# EAGLE schematic NSE2022_ALL (EAGLE 9.6.0)
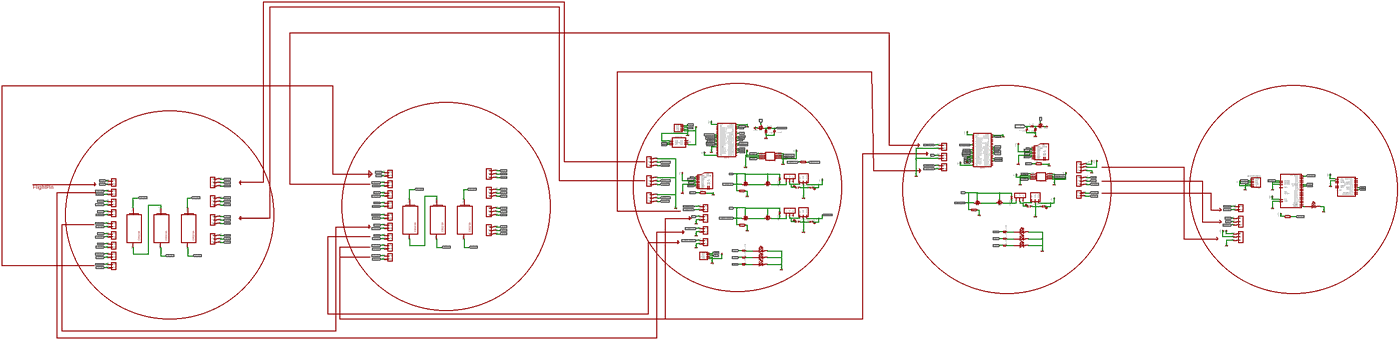
[diagram p0: schematic, sheet 1, overview]
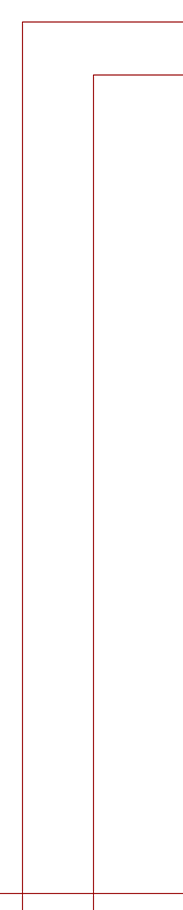
[diagram p1: schematic, sheet 1, part 1 of 8]
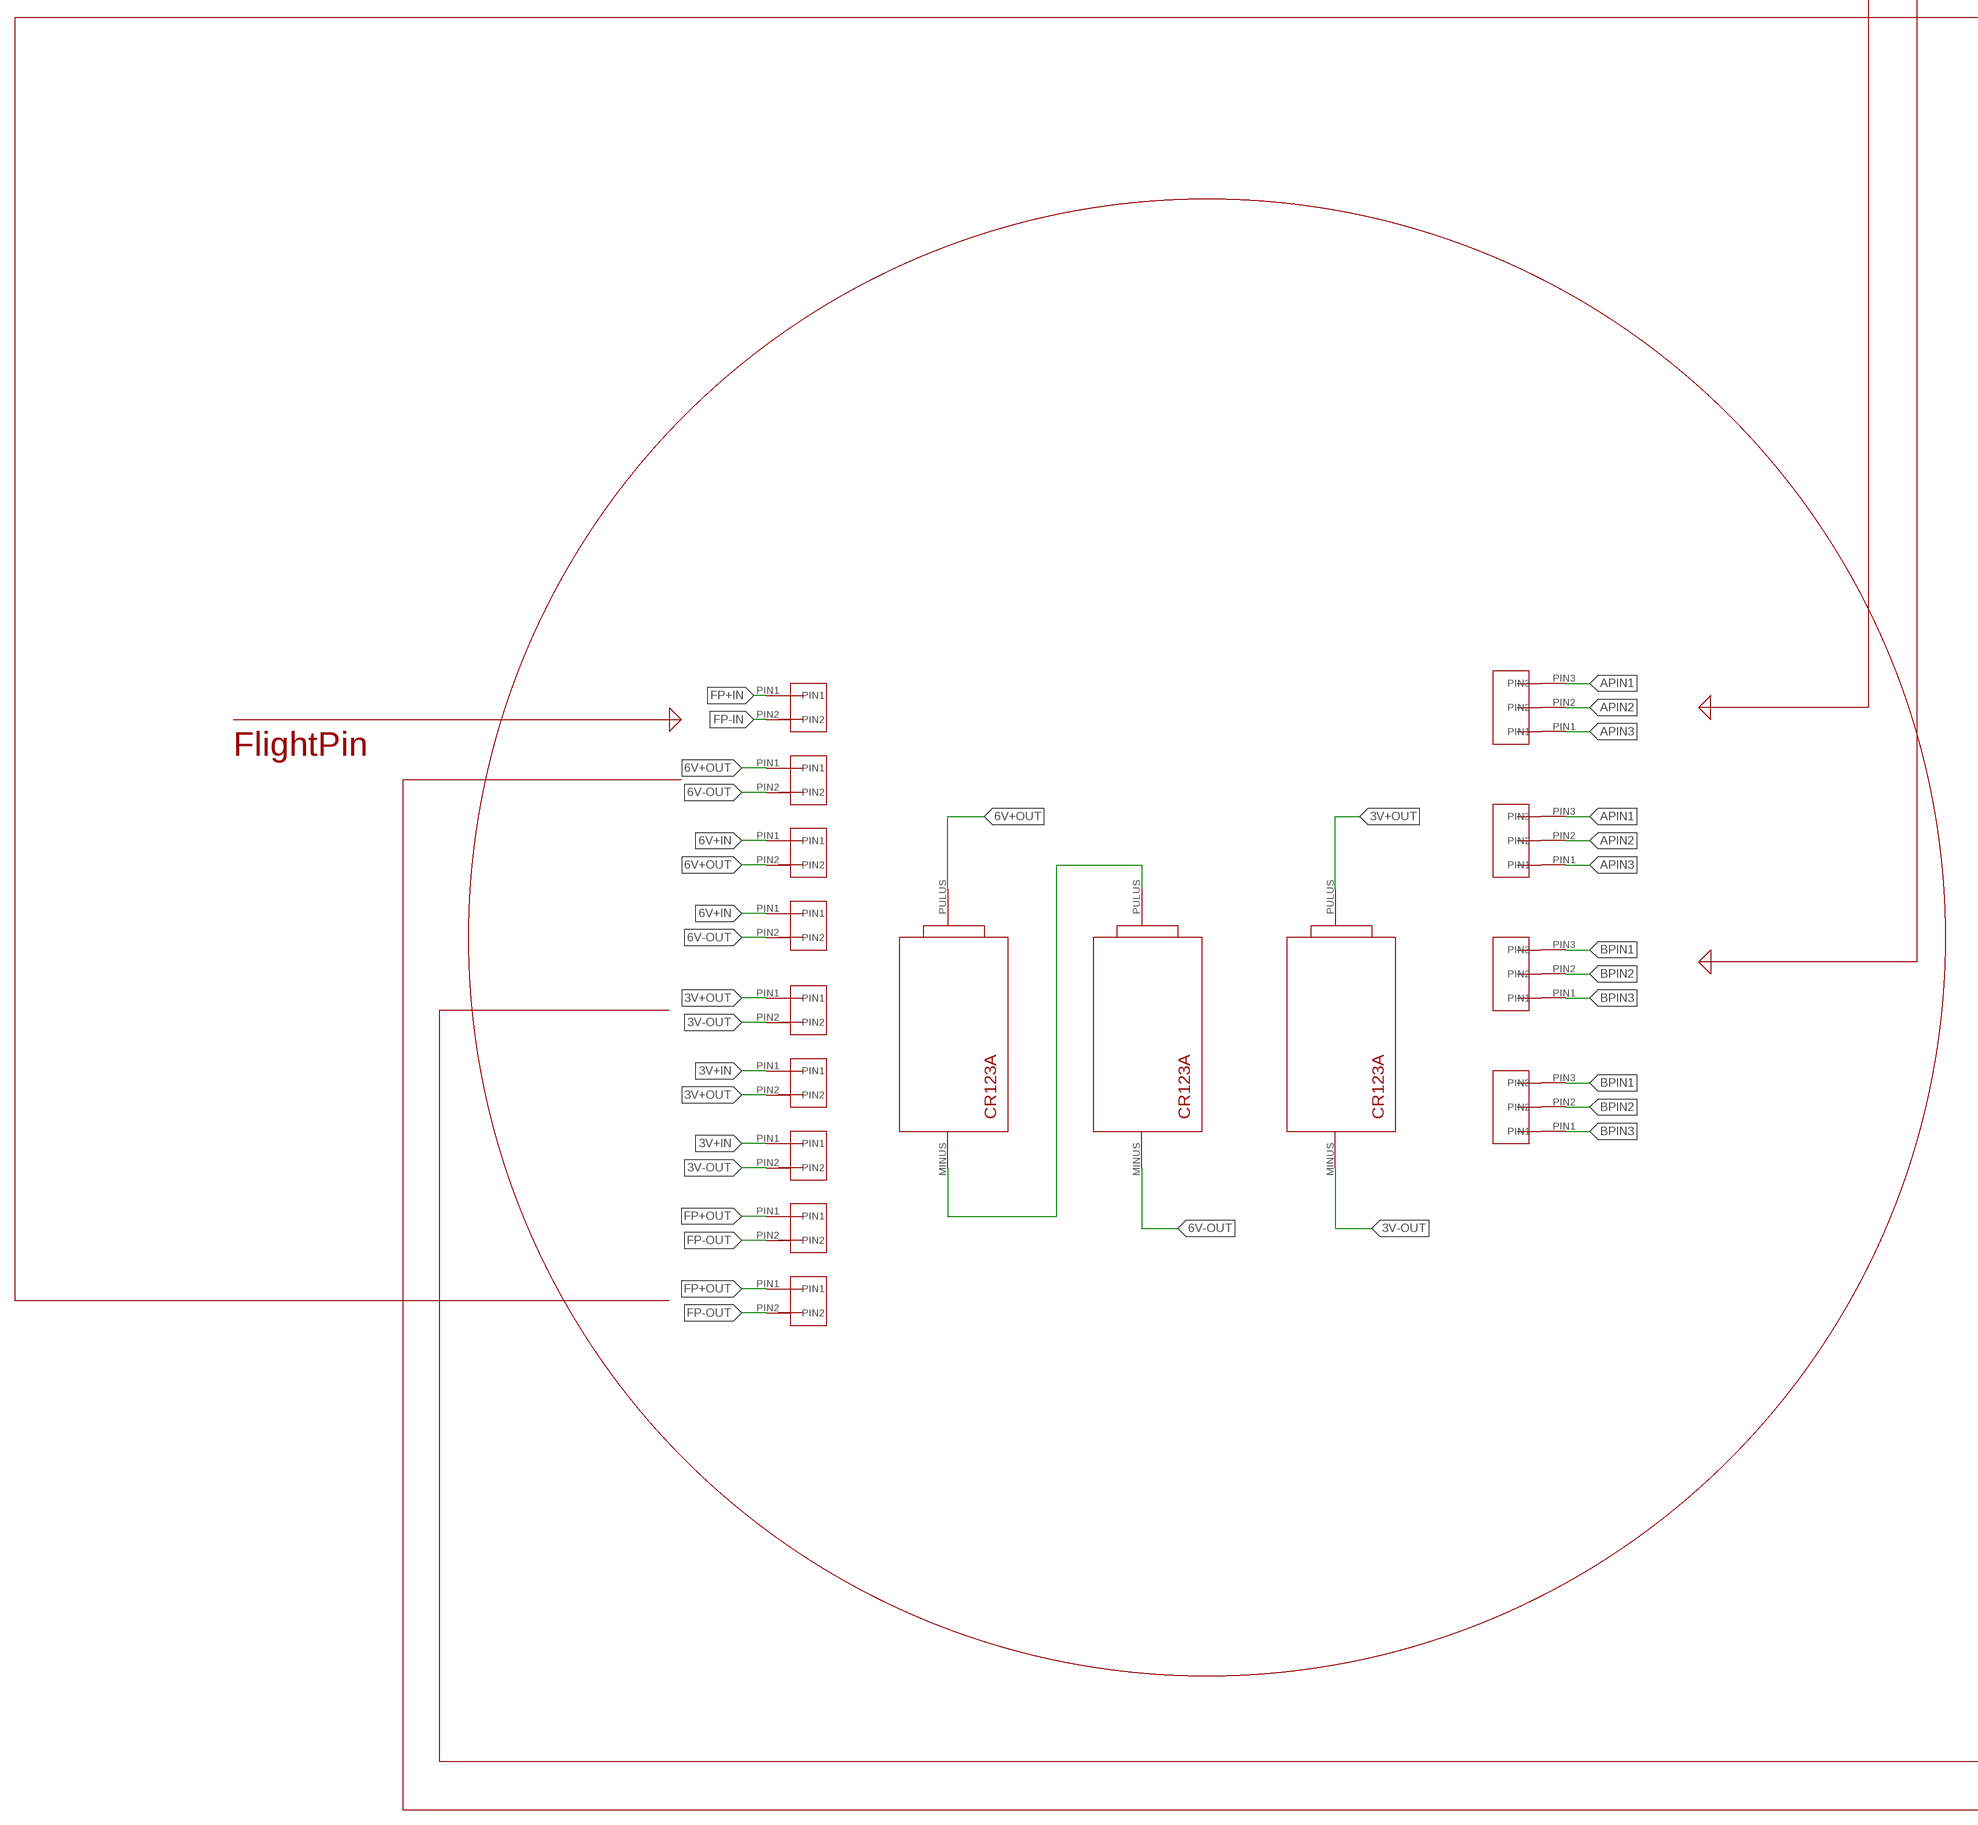
[diagram p2: schematic, sheet 1, part 2 of 8]
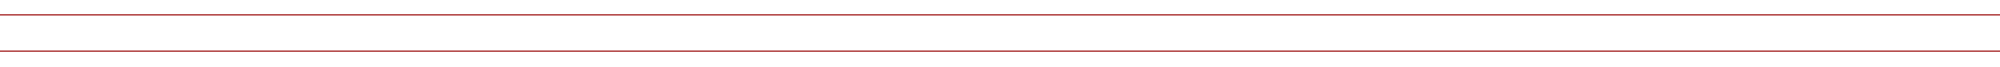
[diagram p3: schematic, sheet 1, part 3 of 8]
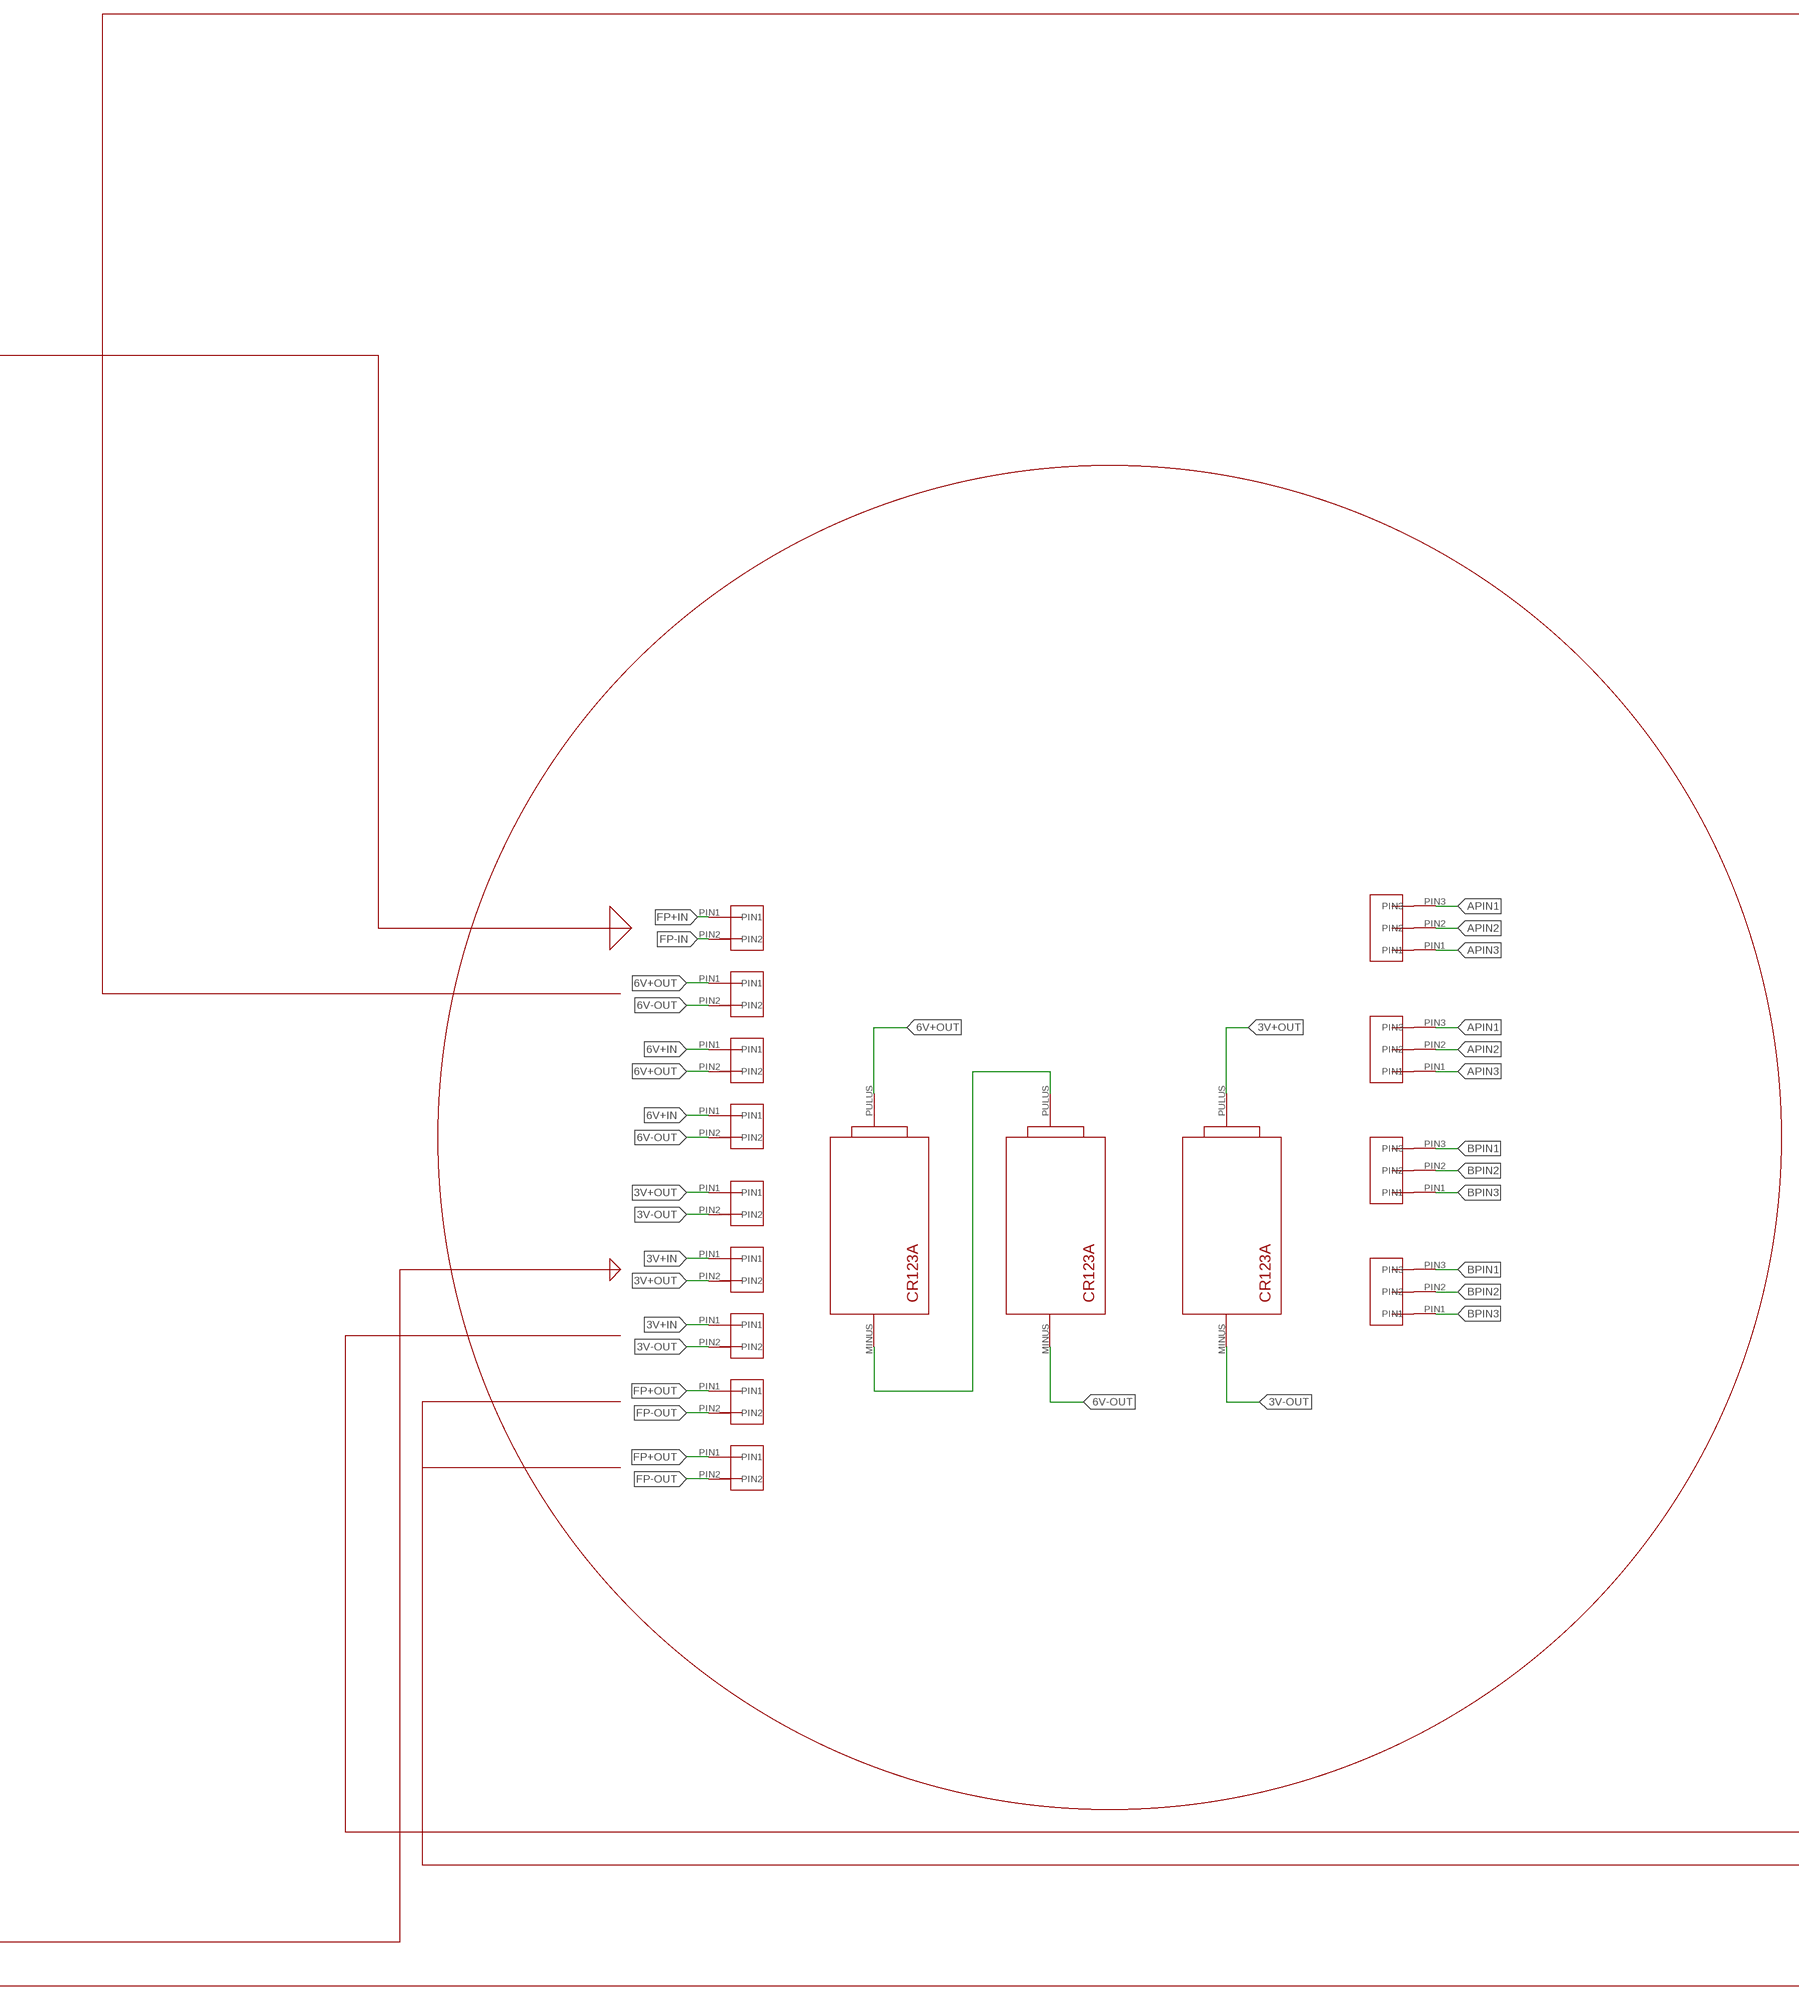
[diagram p4: schematic, sheet 1, part 4 of 8]
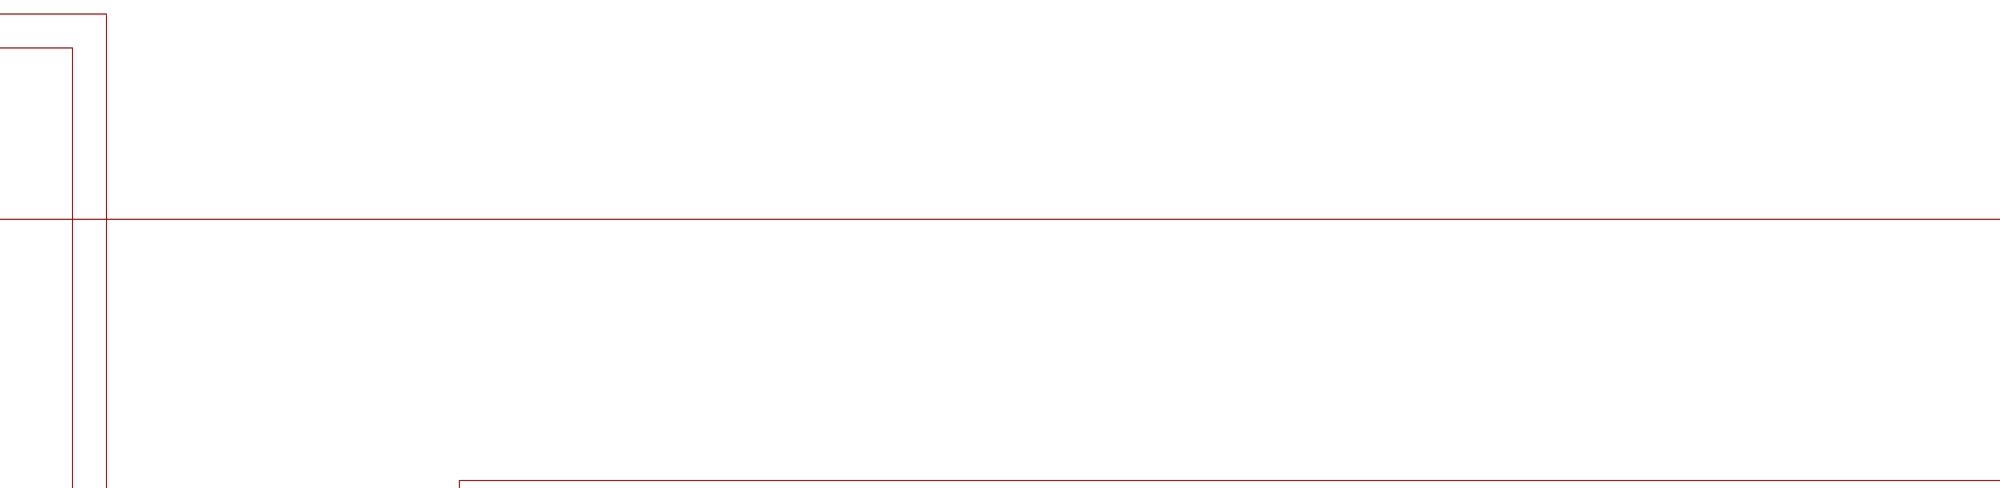
[diagram p5: schematic, sheet 1, part 5 of 8]
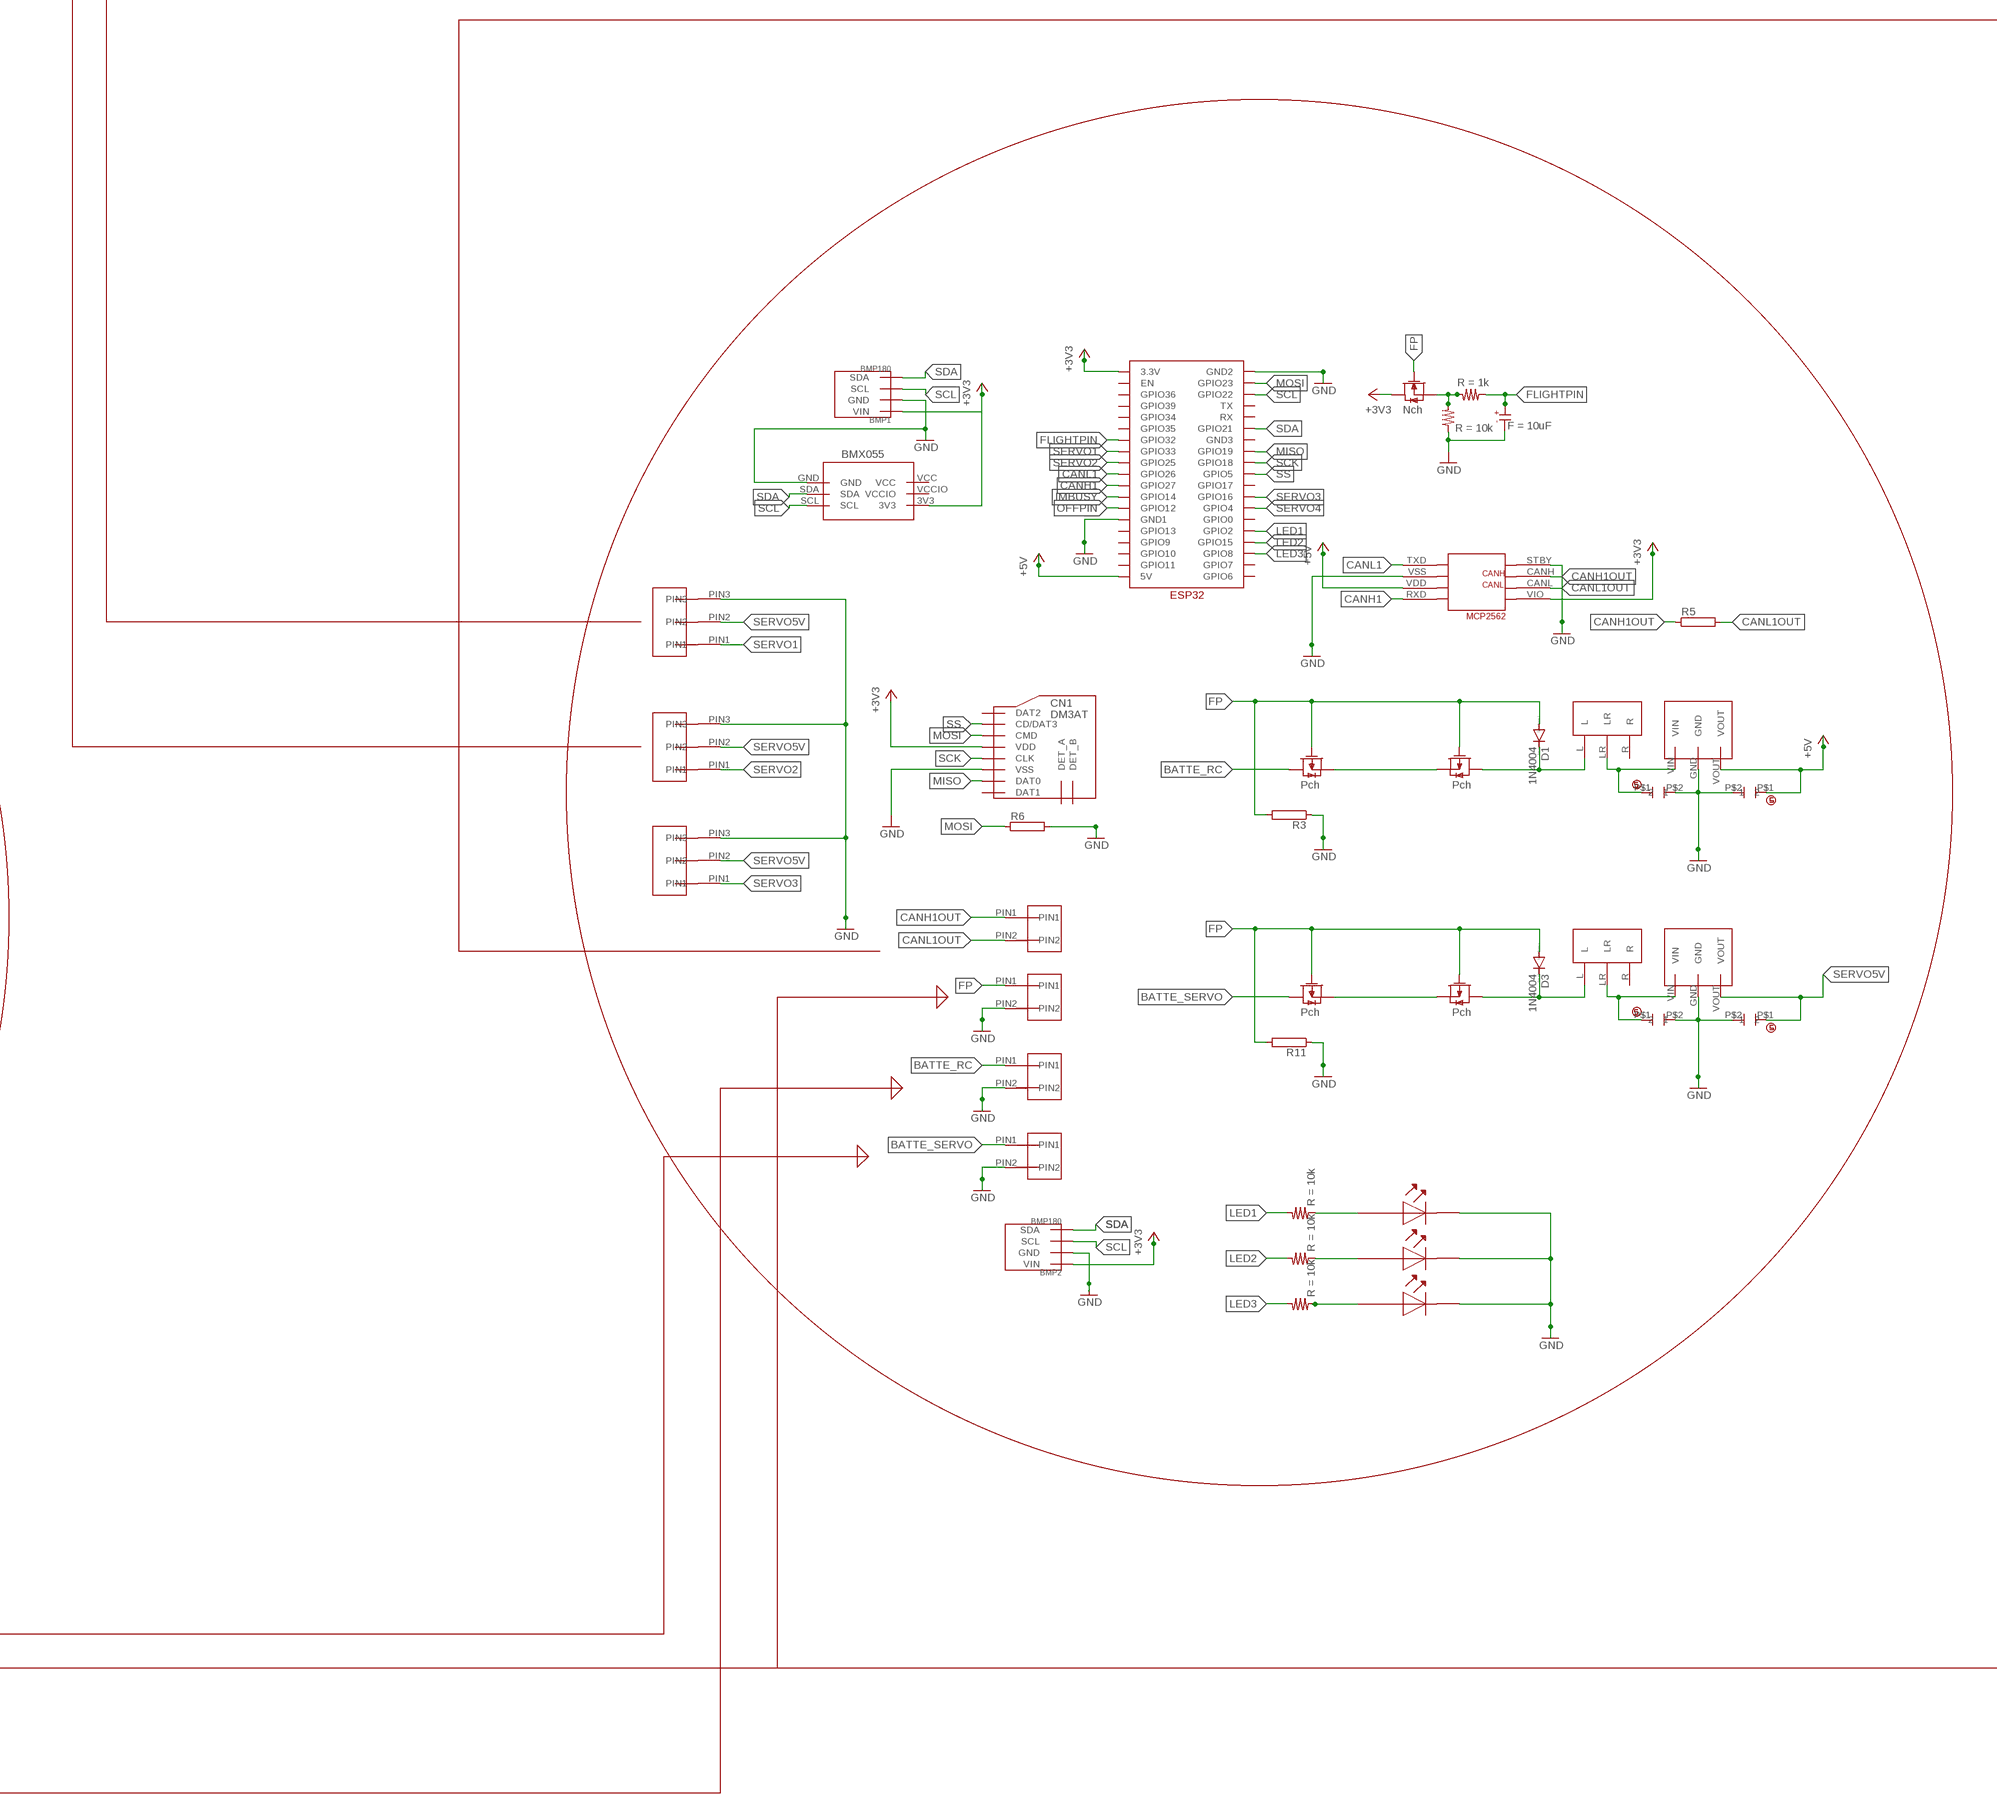
[diagram p6: schematic, sheet 1, part 6 of 8]
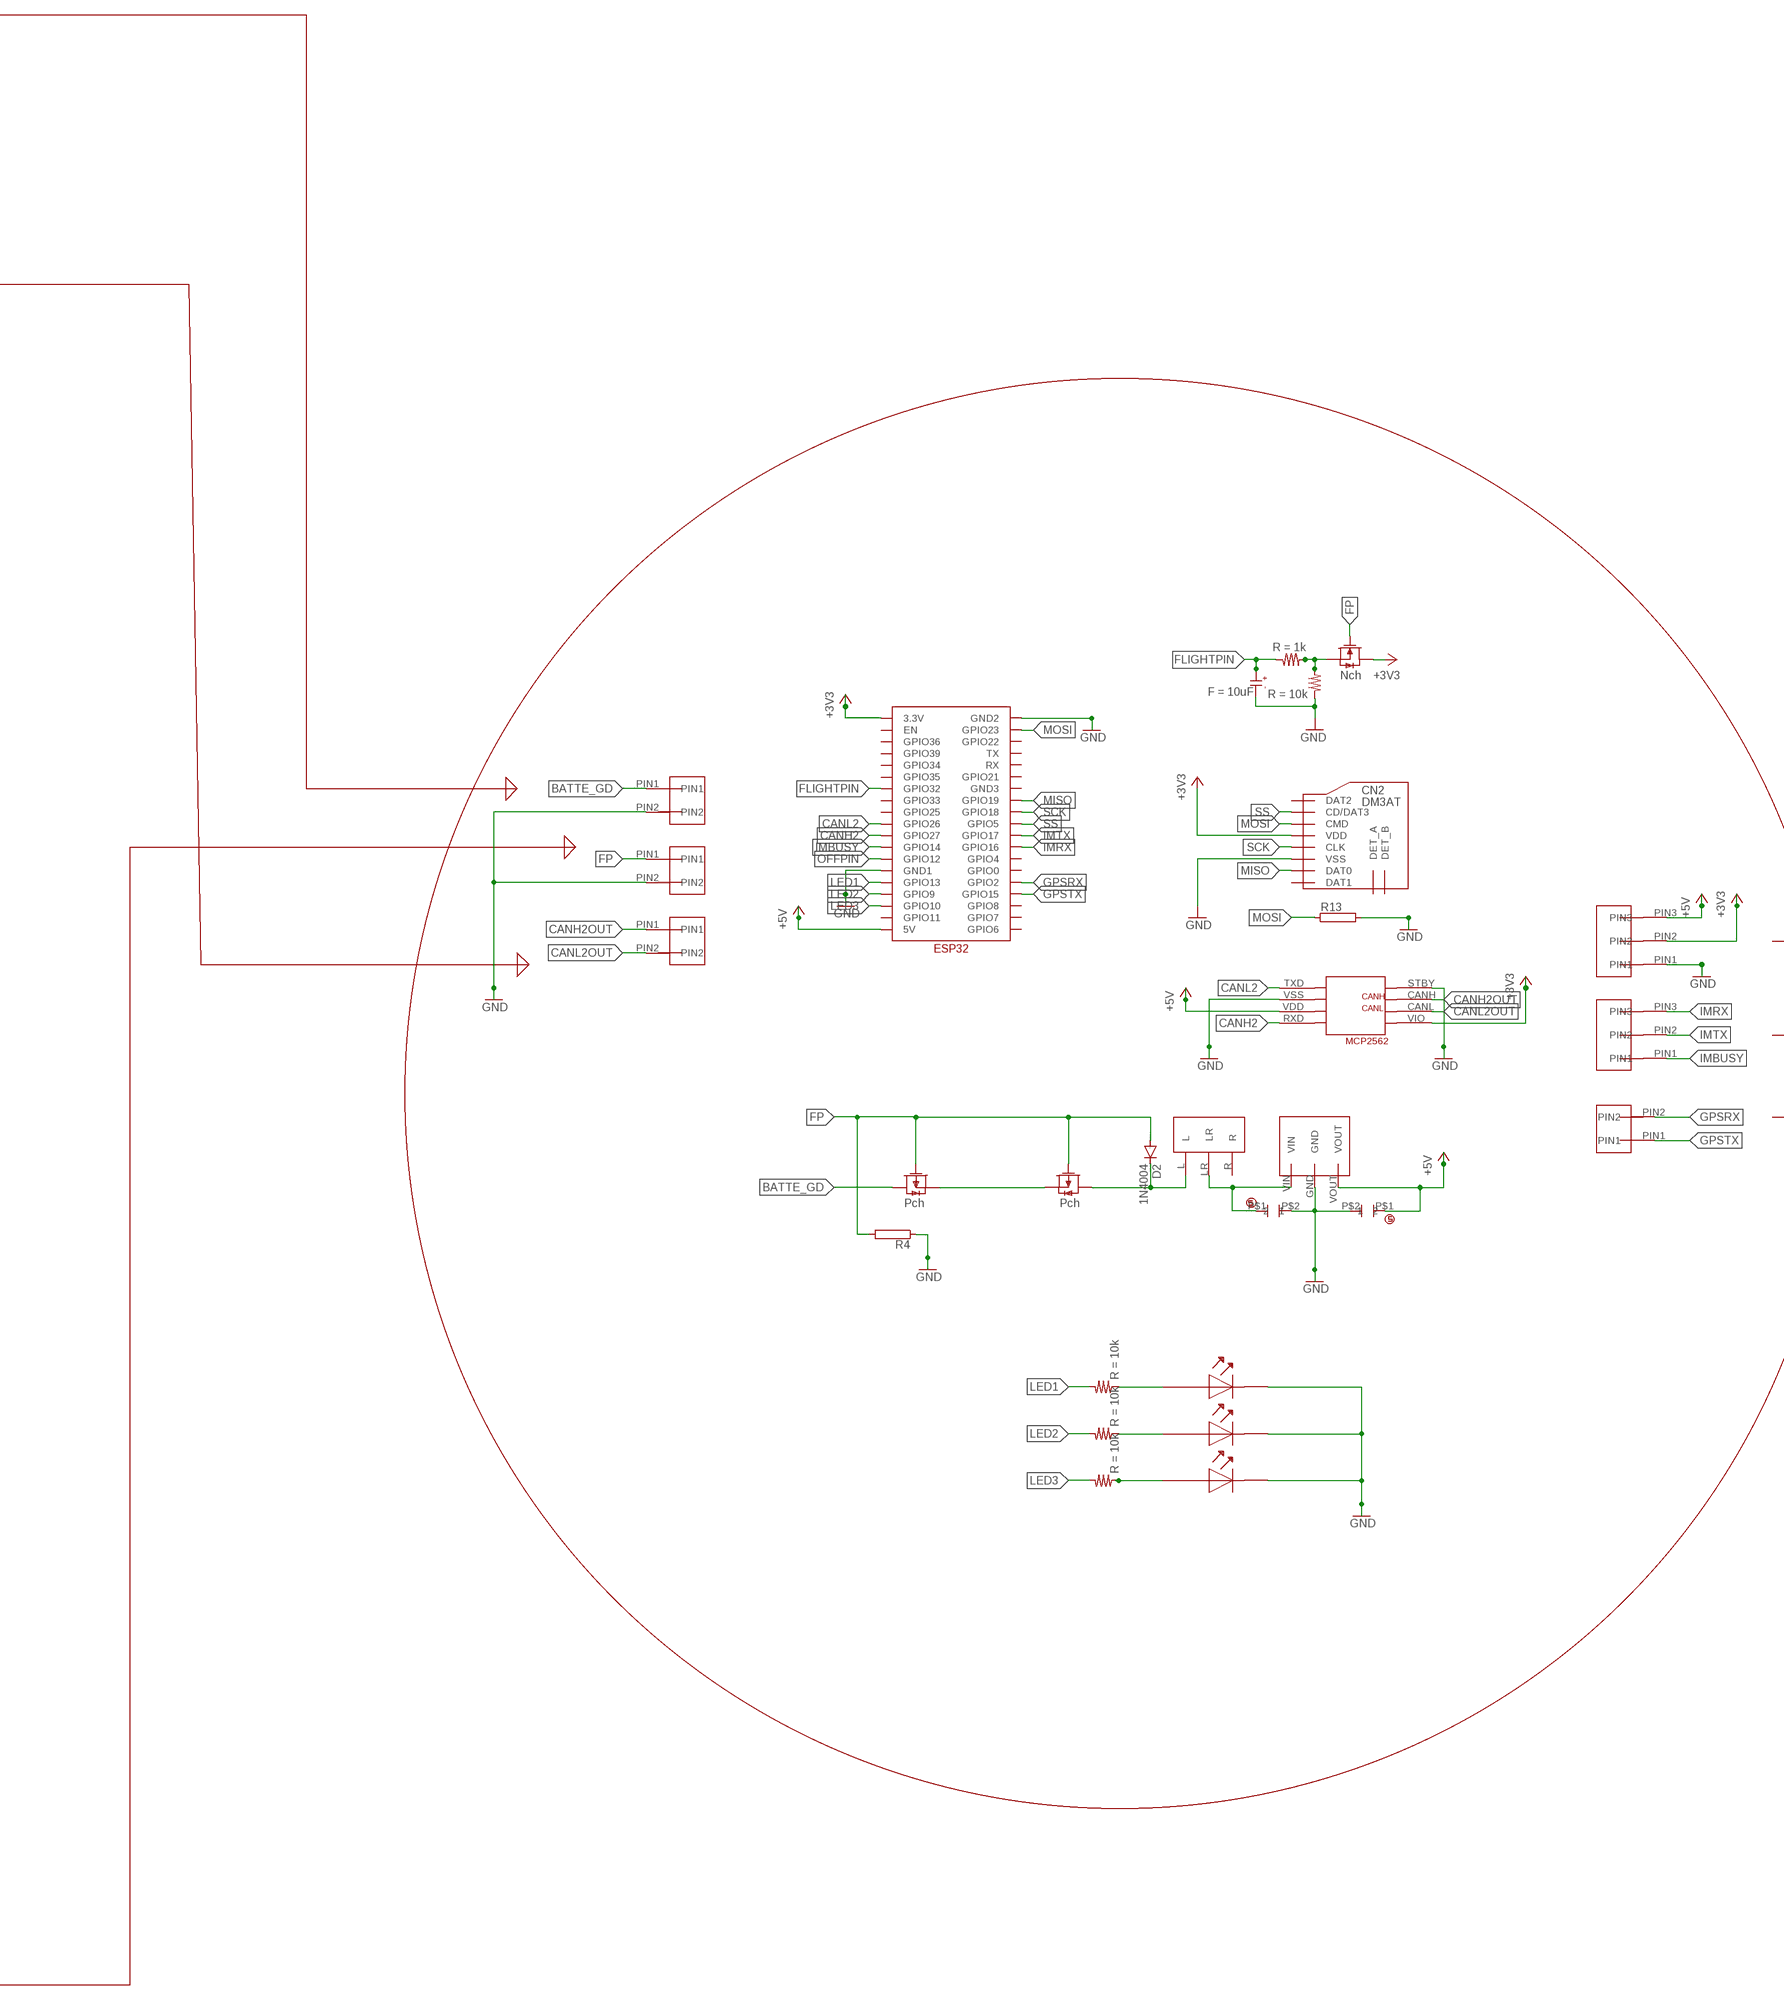
[diagram p7: schematic, sheet 1, part 7 of 8]
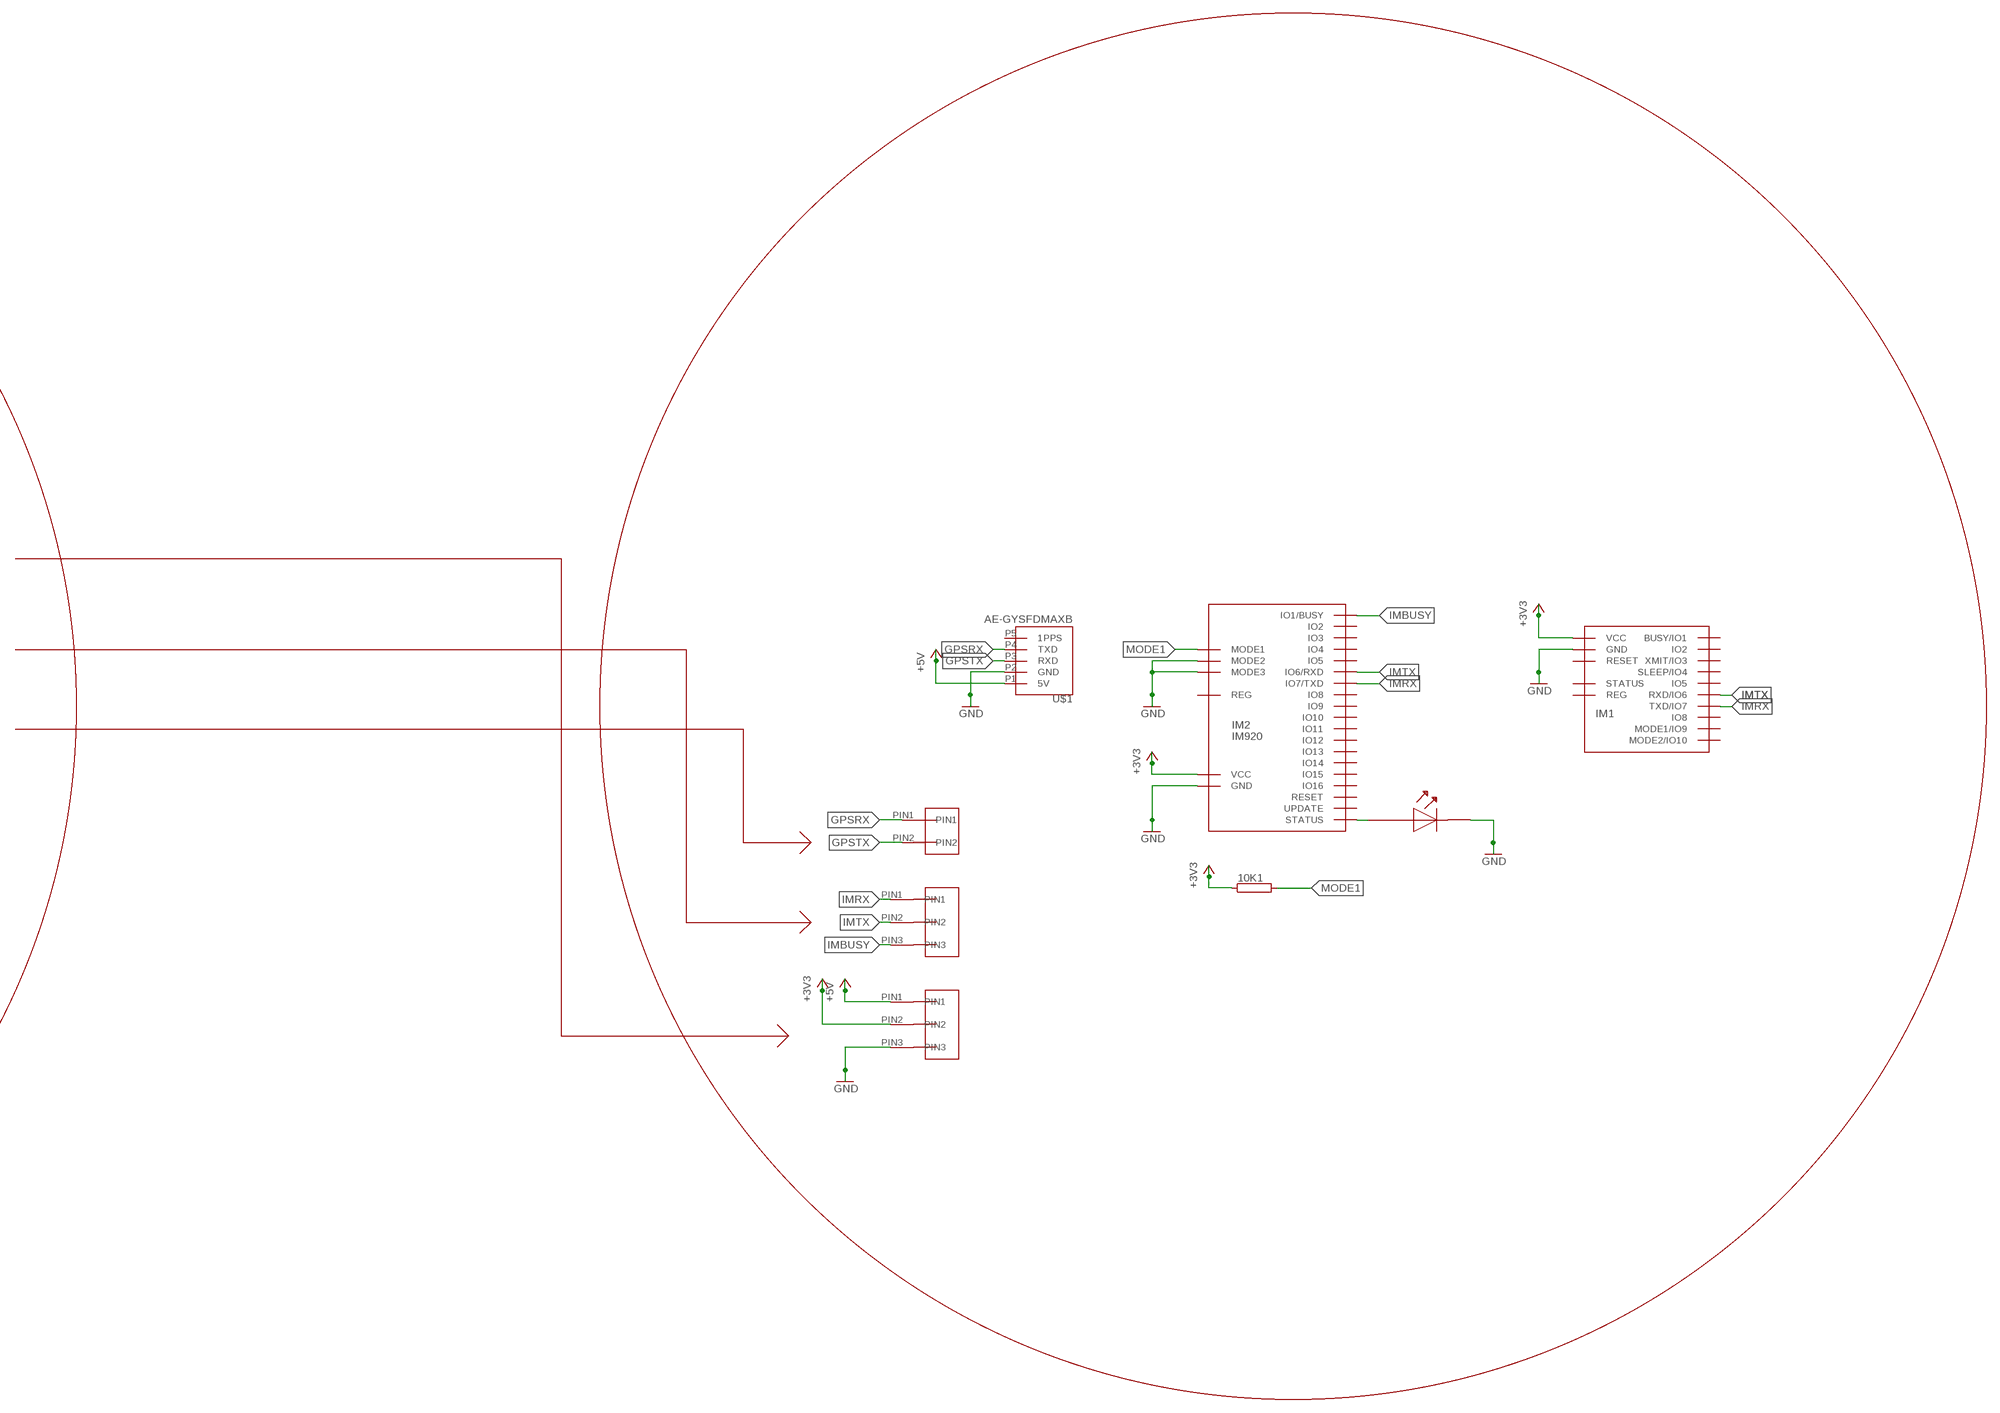
[diagram p8: schematic, sheet 1, part 8 of 8]

## Parts
10K1  RRS02B  [RS02B]
BMP1  BMP180  [GY-68]
BMP2  BMP180  [GY-68]
BMX1  BMX055  [BMX055]
C1  CAPACITOR-ELECTROLYTIC_1  [CAPACITOR-ELECTROLYTIC_1]
C3  CAPACITOR-ELECTROLYTIC_1  [CAPACITOR-ELECTROLYTIC_1]
CERAMIC_CAPACITOR1  CERAMIC_CAPACITOR  [CERAMIC_CAPACITOR]
CERAMIC_CAPACITOR2  CERAMIC_CAPACITOR  [CERAMIC_CAPACITOR]
CERAMIC_CAPACITOR3  CERAMIC_CAPACITOR  [CERAMIC_CAPACITOR]
CERAMIC_CAPACITOR4  CERAMIC_CAPACITOR  [CERAMIC_CAPACITOR]
CERAMIC_CAPACITOR5  CERAMIC_CAPACITOR  [CERAMIC_CAPACITOR]
CERAMIC_CAPACITOR6  CERAMIC_CAPACITOR  [CERAMIC_CAPACITOR]
CN1  DM3AT  [DM3AT]
CN2  DM3AT  [DM3AT]
D1  1N4004  [DO41-10]
D2  1N4004  [DO41-10]
D3  1N4004  [DO41-10]
IM1  IM920C  [IM920C]
IM2  IM920  [IM920]
R1  RESISTER  [REGISTER]
R2  RESISTER  [REGISTER]
R3  RRS02B  [RS02B]
R4  RRS02B  [RS02B]
R5  RRS02B  [RS02B]
R6  RRS02B  [RS02B]
R7  RESISTER  [REGISTER]
R8  RESISTER  [REGISTER]
R9  RESISTER  [REGISTER]
R10  RESISTER  [REGISTER]
R11  RRS02B  [RS02B]
R12  RESISTER  [REGISTER]
R13  RRS02B  [RS02B]
R14  RESISTER  [REGISTER]
R15  RESISTER  [REGISTER]
R16  RESISTER  [REGISTER]
SRIDE_SWTCH1  SRIDE_SWITCH  [SRIDE_SWITCH]
SRIDE_SWTCH2  SRIDE_SWITCH  [SRIDE_SWITCH]
SRIDE_SWTCH3  SRIDE_SWITCH  [SRIDE_SWITCH]
U$1  AE-GYSFDMAXB  [AE-GYSFDMAXB]
U$2  2PIN  [2PIN]
U$3  2SJ681-PCH  [2SJ681]
U$4  ESP32  [ESP32]
U$5  2SJ681-PCH  [2SJ681]
U$6  M78AR05-1  [M78AR05-1]
U$7  2SK4017-NCH  [2SK4017]
U$8  2SK4017-NCH  [2SK4017]
U$9  2PIN  [2PIN]
U$10  2PIN  [2PIN]
U$11  2PIN  [2PIN]
U$12  2SJ681-PCH  [2SJ681]
U$13  2SJ681-PCH  [2SJ681]
U$14  M78AR05-1  [M78AR05-1]
U$15  CR123A  [CR123A]
U$16  CR123A  [CR123A]
U$17  CR123A  [CR123A]
U$18  2PIN  [2PIN]
U$19  2PIN  [2PIN]
U$20  2PIN  [2PIN]
U$21  2PIN  [2PIN]
U$22  2PIN  [2PIN]
U$23  2PIN  [2PIN]
U$24  2PIN  [2PIN]
U$25  CR123A  [CR123A]
U$26  ESP32  [ESP32]
U$27  MCP2562  [MCP2562]
U$28  MCP2562  [MCP2562]
U$29  2PIN  [2PIN]
U$30  2SJ681-PCH  [2SJ681]
U$31  2SJ681-PCH  [2SJ681]
U$32  M78AR05-1  [M78AR05-1]
U$33  2PIN  [2PIN]
U$34  CR123A  [CR123A]
U$35  2PIN  [2PIN]
U$36  2PIN  [2PIN]
U$37  2PIN  [2PIN]
U$38  CR123A  [CR123A]
U$39  2PIN  [2PIN]
U$40  2PIN  [2PIN]
U$41  2PIN  [2PIN]
U$42  3PIN  [3PIN]
U$43  3PIN  [3PIN]
U$44  3PIN  [3PIN]
U$45  2PIN  [2PIN]
U$46  3PIN  [3PIN]
U$47  3PIN  [3PIN]
U$48  3PIN  [3PIN]
U$49  3PIN  [3PIN]
U$50  3PIN  [3PIN]
U$51  3PIN  [3PIN]
U$52  3PIN  [3PIN]
U$53  3PIN  [3PIN]
U$54  LED  [LED]
U$55  LED  [LED]
U$56  2PIN  [2PIN]
U$57  2PIN  [2PIN]
U$58  2PIN  [2PIN]
U$59  3PIN  [3PIN]
U$60  3PIN  [3PIN]
U$61  3PIN  [3PIN]
U$62  3PIN  [3PIN]
U$63  LED  [LED]
U$64  LED  [LED]
U$65  2PIN  [2PIN]
U$66  2PIN  [2PIN]
U$67  2PIN  [2PIN]
U$68  2PIN  [2PIN]
U$69  LED  [LED]
U$70  LED  [LED]
U$71  LED  [LED]

## Nets
3V+IN: U$2.PIN1 U$37.PIN1 U$56.PIN1 U$65.PIN1
3V+OUT: U$17.PULUS(PULAS) U$36.PIN1 U$37.PIN2 U$38.PULUS(PULAS) U$45.PIN1 U$56.PIN2
3V-OUT: U$2.PIN2 U$17.MINUS U$36.PIN2 U$38.MINUS U$45.PIN2 U$65.PIN2
6V+IN: U$10.PIN1 U$11.PIN1 U$67.PIN1 U$68.PIN1
6V+OUT: U$10.PIN2 U$15.PULUS(PULAS) U$25.PULUS(PULAS) U$35.PIN1 U$41.PIN1 U$67.PIN2
6V-OUT: U$11.PIN2 U$16.MINUS U$34.MINUS U$35.PIN2 U$41.PIN2 U$68.PIN2
+3V3: 10K1.1 BMP1.P1(VIN) BMP2.P1(VIN) BMX1.3V3 CN1.VDD CN2.VDD IM1.$P17(VCC) IM2.IO23(VCC) U$4.3.3V U$7.DRAIN U$8.DRAIN U$26.3.3V U$27.VIO U$28.VIO U$46.PIN2 U$48.PIN2
+5V: CERAMIC_CAPACITOR1.P$1 CERAMIC_CAPACITOR5.P$1 U$1.P1(5V) U$4.5V U$6.VOUT U$26.5V U$27.VDD U$28.VDD U$32.VOUT U$46.PIN3 U$48.PIN1
APIN1: U$50.PIN3 U$51.PIN3 U$59.PIN3 U$60.PIN3
APIN2: U$50.PIN2 U$51.PIN2 U$59.PIN2 U$60.PIN2
APIN3: U$50.PIN1 U$51.PIN1 U$59.PIN1 U$60.PIN1
BATTE_GD: U$5.DRAIN U$22.PIN1
BATTE_RC: U$20.PIN1 U$30.DRAIN
BATTE_SERVO: U$13.DRAIN U$21.PIN1
BPIN1: U$52.PIN3 U$53.PIN3 U$61.PIN3 U$62.PIN3
BPIN2: U$52.PIN2 U$53.PIN2 U$61.PIN2 U$62.PIN2
BPIN3: U$52.PIN1 U$53.PIN1 U$61.PIN1 U$62.PIN1
CANH1: U$4.GPIO27 U$27.RXD
CANH1OUT: R5.1 U$18.PIN1 U$27.CANH
CANH2: U$26.GPIO27 U$28.RXD
CANH2OUT: U$24.PIN1 U$28.CANH
CANL1: U$4.GPIO26 U$27.TXD
CANL1OUT: R5.2 U$18.PIN2 U$27.CANL
CANL2: U$26.GPIO26 U$28.TXD
CANL2OUT: U$24.PIN2 U$28.CANL
FLIGHTPIN: C1.KS C3.KS R8.A R10.A U$4.GPIO32 U$26.GPIO32
FP: D1.A D2.A D3.A R3.2 R4.2 R11.2 U$3.GATE U$5.GATE U$7.GATE U$8.GATE U$12.GATE U$13.GATE U$19.PIN1 U$23.PIN1 U$30.GATE U$31.GATE
FP+IN: U$39.PIN1 U$57.PIN1
FP+OUT: U$9.PIN1 U$40.PIN1 U$58.PIN1 U$66.PIN1
FP-IN: U$39.PIN2 U$57.PIN2
FP-OUT: U$9.PIN2 U$40.PIN2 U$58.PIN2 U$66.PIN2
GND: BMP1.P2(GND) BMP2.P2(GND) BMX1.GND C1.AN C3.AN CERAMIC_CAPACITOR1.P$2 CERAMIC_CAPACITOR2.P$2 CERAMIC_CAPACITOR3.P$2 CERAMIC_CAPACITOR4.P$2 CERAMIC_CAPACITOR5.P$2 CERAMIC_CAPACITOR6.P$2 CN1.VSS CN2.VSS IM1.$P18(GND) IM2.IO18(MODE2) IM2.IO19(MODE3) IM2.IO24(GND) R3.1 R4.1 R6.2 R7.A R9.A R11.1 R13.2 U$1.P2(GND) U$4.GND1 U$6.GND U$14.GND U$19.PIN2 U$20.PIN2 U$21.PIN2 U$22.PIN2 U$23.PIN2 U$26.GND1 U$27.STBY U$27.VSS U$28.STBY U$28.VSS U$32.GND U$42.PIN3 U$43.PIN3 U$44.PIN3 U$46.PIN1 U$48.PIN3 U$54.PLUS(OUT) U$55.PLUS(OUT) U$63.PLUS(OUT) U$64.PLUS(OUT) U$69.PLUS(OUT) U$70.PLUS(OUT) U$71.PLUS(OUT)
GPSRX: U$1.P4(TXD) U$26.GPIO2 U$29.PIN2 U$33.PIN1
GPSTX: U$1.P3(RXD) U$26.GPIO15 U$29.PIN1 U$33.PIN2
IMBUSY: IM2.IO1(IO1/BUSY) U$4.GPIO14 U$26.GPIO14 U$47.PIN3 U$49.PIN1
IMRX: IM1.$P7(TXD/IO7) IM2.IO7(IO7/TXD) U$26.GPIO16 U$47.PIN1 U$49.PIN3
IMTX: IM1.$P6(RXD/IO6) IM2.IO6(IO6/RXD) U$26.GPIO17 U$47.PIN2 U$49.PIN2
LED1: R1.B R12.B U$4.GPIO2 U$26.GPIO13
LED2: R2.B R14.B U$4.GPIO15 U$26.GPIO9
LED3: R15.B R16.B U$4.GPIO8 U$26.GPIO10
MISO: CN1.DAT0 CN2.DAT0 U$4.GPIO19 U$26.GPIO19
MODE1: 10K1.2 IM2.IO17(MODE1)
MOSI: CN1.CMD CN2.CMD R6.1 R13.1 U$4.GPIO23 U$26.GPIO23
N$1: U$4.GND2 U$26.GND2 ; supply symbol labelled GND
N$2: U$12.SOURCE U$13.SOURCE
N$3: U$3.SOURCE U$5.SOURCE
N$4: CERAMIC_CAPACITOR2.P$1 SRIDE_SWTCH3.LR U$6.VIN
N$5: R9.B R10.B U$8.SOURCE
N$6: CERAMIC_CAPACITOR4.P$1 SRIDE_SWTCH1.LR U$14.VIN
N$7: IM2.IO21(STATUS) U$54.MINUS(IN)
N$8: U$15.MINUS U$16.PULUS(PULAS)
N$9: R7.B R8.B U$7.SOURCE
N$10: D1.C SRIDE_SWTCH2.L U$31.DRAIN
N$11: D3.C SRIDE_SWTCH1.L U$12.DRAIN
N$12: D2.C SRIDE_SWTCH3.L U$3.DRAIN
N$13: U$25.MINUS U$34.PULUS(PULAS)
N$14: R1.A U$55.MINUS(IN)
N$15: R12.A U$63.MINUS(IN)
N$16: R14.A U$64.MINUS(IN)
N$17: R15.A U$69.MINUS(IN)
N$18: R2.A U$70.MINUS(IN)
N$19: R16.A U$71.MINUS(IN)
N$22: U$30.SOURCE U$31.SOURCE
N$24: CERAMIC_CAPACITOR6.P$1 SRIDE_SWTCH2.LR U$32.VIN
OFFPIN: U$4.GPIO12 U$26.GPIO12
SCK: CN1.CLK CN2.CLK U$4.GPIO18 U$26.GPIO18
SCL: BMP1.P3(SCL) BMP2.P3(SCL) BMX1.SCL U$4.GPIO22
SDA: BMP1.P4(SDA) BMP2.P4(SDA) BMX1.SDA U$4.GPIO21
SERVO1: U$4.GPIO33 U$42.PIN1
SERVO2: U$4.GPIO25 U$43.PIN1
SERVO3: U$4.GPIO16 U$44.PIN1
SERVO4: U$4.GPIO4
SERVO5V: CERAMIC_CAPACITOR3.P$1 U$14.VOUT U$42.PIN2 U$43.PIN2 U$44.PIN2
SS: CN1.CD/DAT3 CN2.CD/DAT3 U$4.GPIO5 U$26.GPIO5
Unconnected: CN1.DAT1 CN1.DAT2 CN1.DET_A CN1.DET_B CN2.DAT1 CN2.DAT2 CN2.DET_A CN2.DET_B IM1.$P1(BUSY/IO1) IM1.$P2(IO2) IM1.$P3(XMIT/IO3) IM1.$P4(SLEEP/IO4) IM1.$P5(IO5) IM1.$P8(IO8) IM1.$P9(MODE1/IO9) IM1.$P10(MODE2/IO10) IM1.$P15(STATUS) IM1.$P16(REG) IM1.$P19(RESET) IM2.IO2 IM2.IO3 IM2.IO4 IM2.IO5 IM2.IO8 IM2.IO9 IM2.IO10 IM2.IO11 IM2.IO12 IM2.IO13 IM2.IO14 IM2.IO15 IM2.IO16 IM2.IO20(UPDATE) IM2.IO22(REG) IM2.IO25(RESET) SRIDE_SWTCH1.R SRIDE_SWTCH2.R SRIDE_SWTCH3.R U$1.P5(1PPS) U$4.EN U$4.GND3 U$4.GPIO0 U$4.GPIO6 U$4.GPIO7 U$4.GPIO9 U$4.GPIO10 U$4.GPIO11 U$4.GPIO13 U$4.GPIO17 U$4.GPIO34 U$4.GPIO35 U$4.GPIO36 U$4.GPIO39 U$4.RX U$4.TX U$26.EN U$26.GND3 U$26.GPIO0 U$26.GPIO4 U$26.GPIO6 U$26.GPIO7 U$26.GPIO8 U$26.GPIO11 U$26.GPIO21 U$26.GPIO22 U$26.GPIO25 U$26.GPIO33 U$26.GPIO34 U$26.GPIO35 U$26.GPIO36 U$26.GPIO39 U$26.RX U$26.TX

## Notes on the sheet
- FlightPin

## Power pins joined to a net without a drawn wire
VCC: BMX1.VCC
VCCIO: BMX1.VCCIO

## Library data of the parts
10K1 R3-R6 R11 R13 = resistor-power:R: Power Resitor; OC_FARNELL: unknown; OC_NEWARK: unknown
BMP1 BMP2 = BMP180:BMP180
BMX1 = BMX055:BMX055
C1 C3 = normal capacitor:CAPACITOR-ELECTROLYTIC_1; F: 10uF
CERAMIC_CAPACITOR1-CERAMIC_CAPACITOR6 = capacitor:CERAMIC_CAPACITOR: ceramic_capacitor
CN1 CN2 = microSD:DM3AT
D1-D3 = diode:1N4004: DIODE general purpose rectifier, 1 A
IM1 = IM920_SET:IM920C
IM2 = IM920:IM920
R1 R2 R7 R9 R12 R14-R16 = normal register:RESISTER; R: 10k
R8 R10 = normal register:RESISTER; R: 1k
SRIDE_SWTCH1-SRIDE_SWTCH3 = Switches:SRIDE_SWITCH
U$1 = AE-GYSFDMAXB:AE-GYSFDMAXB
U$2 U$9-U$11 U$18-U$24 U$29 U$33 U$35-U$37 U$39-U$41 U$45 U$56-U$58 U$65-U$68 = 2PIN:2PIN
U$3 U$5 U$12 U$13 U$30 U$31 = MOSFET:2SJ681-PCH
U$4 U$26 = ESP32:ESP32
U$6 U$14 U$32 = M78AR05-1:M78AR05-1
U$7 U$8 = MOSFET:2SK4017-NCH
U$15-U$17 U$25 U$34 U$38 = CR123A:CR123A
U$27 U$28 = MCP2562:MCP2562
U$42-U$44 U$46-U$53 U$59-U$62 = 3PIN:3PIN
U$54 U$55 U$63 U$64 U$69-U$71 = LEDkato:LED